# Altium project ultrasonic_ranging.PrjPcb
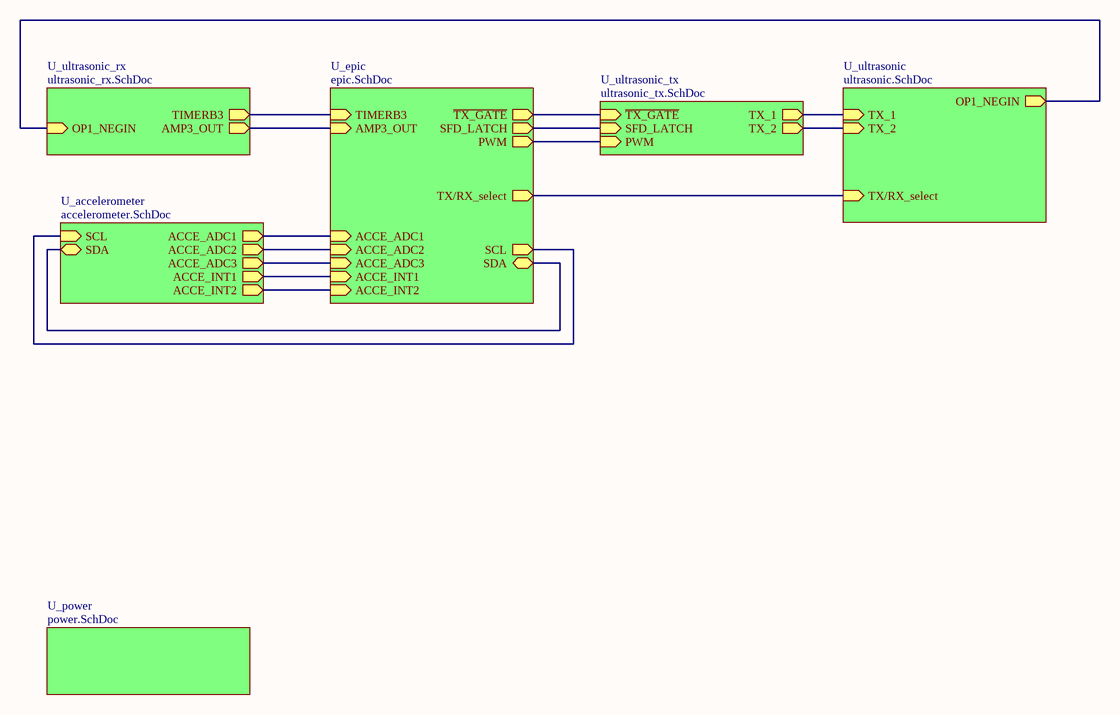
[diagram p0: ultrasonic_top.SchDoc]
7 sheets, 68 parts. Net scope: hierarchical (ports join the sheet entries above them; power ports are global).
Board files: ultrasounic.PcbDoc, ultrasonic_revB.PcbDoc
Sheets:
  ultrasonic_top.SchDoc
    U_accelerometer = accelerometer.SchDoc
    U_epic = epic.SchDoc
    U_ultrasonic = ultrasonic.SchDoc
    U_ultrasonic_rx = ultrasonic_rx.SchDoc
    U_ultrasonic_tx = ultrasonic_tx.SchDoc
    U_power = power.SchDoc

## Sheet ultrasonic_top.SchDoc: Ultrasonic
size Letter; Author: Kuo, Huang; Revision: 2.0; SheetNumber: 1; SheetTotal: 7

### Sub-sheets
U_accelerometer = accelerometer.SchDoc: ACCE_ADC1 (out), ACCE_ADC2 (out), ACCE_ADC3 (out), ACCE_INT1 (out), ACCE_INT2 (out), SCL (in), SDA (bidir)
U_epic = epic.SchDoc: TIMERB3 (in), PWM (out), TX/RX_select (out), ~{TX_GATE} (out), AMP3_OUT (in), ACCE_ADC1 (in), ACCE_ADC2 (in), ACCE_ADC3 (in), ACCE_INT1 (in), ACCE_INT2 (in), SCL (out), SDA (bidir), SFD_LATCH (out)
U_power = power.SchDoc: no entries
U_ultrasonic = ultrasonic.SchDoc: TX/RX_select (in), OP1_NEGIN (out), TX_1 (in), TX_2 (in)
U_ultrasonic_rx = ultrasonic_rx.SchDoc: TIMERB3 (out), OP1_NEGIN (in), AMP3_OUT (out)
U_ultrasonic_tx = ultrasonic_tx.SchDoc: TX_1 (out), TX_2 (out), ~{TX_GATE} (in), SFD_LATCH (in), PWM (in)

### Nets
ACCE_ADC1: sheet U_accelerometer/ACCE_ADC1, sheet U_epic/ACCE_ADC1
ACCE_ADC2: sheet U_accelerometer/ACCE_ADC2, sheet U_epic/ACCE_ADC2
ACCE_ADC3: sheet U_accelerometer/ACCE_ADC3, sheet U_epic/ACCE_ADC3
ACCE_INT1: sheet U_accelerometer/ACCE_INT1, sheet U_epic/ACCE_INT1
ACCE_INT2: sheet U_accelerometer/ACCE_INT2, sheet U_epic/ACCE_INT2
AMP3_OUT: sheet U_epic/AMP3_OUT, sheet U_ultrasonic_rx/AMP3_OUT
OP1_NEGIN: sheet U_ultrasonic/OP1_NEGIN, sheet U_ultrasonic_rx/OP1_NEGIN
PWM: sheet U_epic/PWM, sheet U_ultrasonic_tx/PWM
SCL: sheet U_accelerometer/SCL, sheet U_epic/SCL
SDA: sheet U_accelerometer/SDA, sheet U_epic/SDA
~{TX_GATE}: sheet U_epic/~{TX_GATE}, sheet U_ultrasonic_tx/~{TX_GATE}
TX/RX_select: sheet U_epic/TX/RX_select, sheet U_ultrasonic/TX/RX_select
TX_1: sheet U_ultrasonic/TX_1, sheet U_ultrasonic_tx/TX_1
TX_2: sheet U_ultrasonic/TX_2, sheet U_ultrasonic_tx/TX_2
NetC17_1: sheet U_epic/TIMERB3, sheet U_ultrasonic_rx/TIMERB3
NetU1_4: sheet U_epic/SFD_LATCH, sheet U_ultrasonic_tx/SFD_LATCH

### Notes on the sheet
- Title
- Date:
- Author:
- Revision:
- Sheet
- of
- University of Michigan
- File:

## Sheet accelerometer.SchDoc: Ultrasonic
size Letter; Author: Kuo, Huang; Revision: 2.0; SheetNumber: 7; SheetTotal: 7
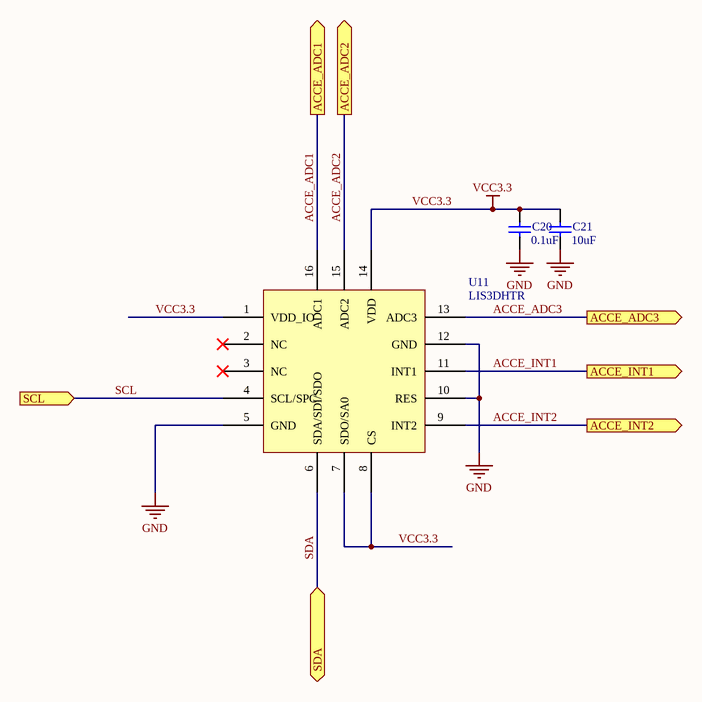
[diagram p1: accelerometer.SchDoc]

### Parts
C20  value 0.1uF  [1608[0603]]  (hidden comment: Cap Semi)
C21  value 10uF  [1608[0603]]  (hidden comment: Cap Semi)
U11  LIS3DHTR  [LGA-16]

### Ports
ACCE_ADC1 (out), ACCE_ADC2 (out), ACCE_ADC3 (out), ACCE_INT1 (out), ACCE_INT2 (out), SCL (in), SDA (bidir)

### Nets
GND: C20.1 C21.1 U11.5(GND) U11.10(RES) U11.12(GND)
VCC3.3: C20.2 C21.2 U11.1(VDD_IO) U11.7(SDO/SA0) U11.8(CS) U11.14(VDD)
ACCE_ADC1: U11.16(ADC1) ; port ACCE_ADC1
ACCE_ADC2: U11.15(ADC2) ; port ACCE_ADC2
ACCE_ADC3: U11.13(ADC3) ; port ACCE_ADC3
ACCE_INT1: U11.11(INT1) ; port ACCE_INT1
ACCE_INT2: U11.9(INT2) ; port ACCE_INT2
SCL: U11.4(SCL/SPC) ; port SCL
SDA: U11.6(SDA/SDI/SDO) ; port SDA

Not connected (* = marked no-connect by the designer): U11 2(NC)* 3(NC)*

### Notes on the sheet
- Title
- Date:
- Author:
- Revision:
- Sheet
- of
- University of Michigan
- File:

### Library data of the parts
C20 C21 = Cap Semi: Capacitor (Semiconductor SIM Model); Published: 8-Jun-2000; LatestRevisionDate: 29-May-2009; LatestRevisionNote: IPC-7351 Footprint Added.; PackageReference: C1206; Publisher: Altium Limited; PackageDescription: Chip Capacitor
U11 = LIS3DHTR: MEMS digital output motion sensor; Supplier 1: Digi-Key; Supplier Part Number 1: 497-10613-6-ND

## Sheet epic.SchDoc: Ultrasonic
size Letter; Author: Kuo, Huang; Organization: Altium Limited; Address1: L3, 12a Rodborough Rd; Address2: Frenchs Forest; Address3: NSW; Address4: Australia 2086; Revision: 2.0; SheetNumber: 3; SheetTotal: 7
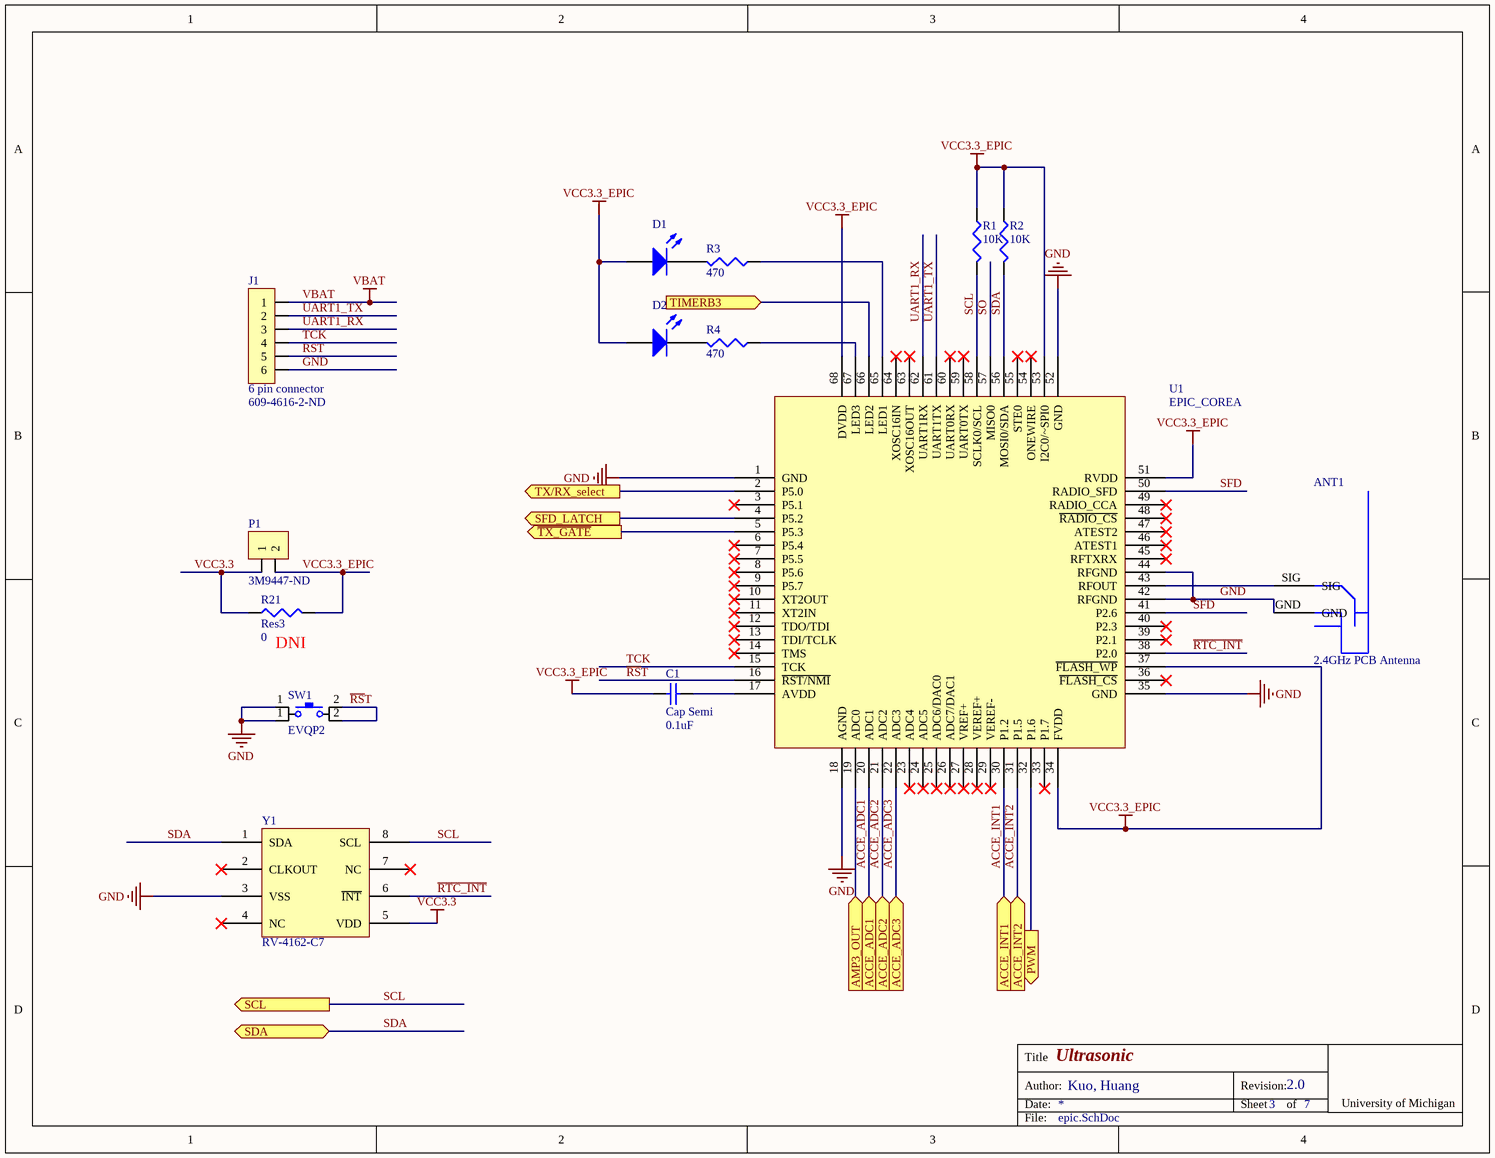
[diagram p2: epic.SchDoc]

### Parts
ANT1  2.4GHz PCB Antenna  [Inverted F Antenna]
C1  Cap Semi  value 0.1uF  [1608[0603]]
D1  LED3  [J1-0603]  (value not drawn)
D2  LED3  [J1-0603]  (value not drawn)
J1  6 pin connector  Supplier Part Number 2: 609-4616-2-ND  [Micro USB]
P1  Supplier Part Number 1: 3M9447-ND  [1x2 header]  (hidden comment: 1 x 2 header)
R1  10K  [J1-0603]
R2  10K  [J1-0603]
R3  470  [J1-0603]
R4  470  [J1-0603]
R21  Res3  value 0  [J1-0603]
SW1  EVQP2  [EVQP2]
U1  EPIC_COREA  [EPIC_LCC68]
Y1  RV-4162-C7  [RV4162]

### Ports
ACCE_ADC1 (in), ACCE_ADC2 (in), ACCE_ADC3 (in), ACCE_INT1 (in), ACCE_INT2 (in), AMP3_OUT (in), PWM (out), SCL (out), SDA (bidir), SFD_LATCH (out), TIMERB3 (in), TX/RX_select (out), ~{TX_GATE} (out)

### Nets
GND: ANT1.GND J1.6 SW1.1 U1.1(GND) U1.18(AGND) U1.35(GND) U1.42(RFGND) U1.44(RFGND) U1.52(GND) Y1.3(VSS)
VBAT: J1.1
VCC3.3: P1.1 R21.1 Y1.5(VDD)
VCC3.3_EPIC: C1.1 D1.1(A) D2.1(A) P1.2 R1.1 R2.1 R21.2 U1.34(FVDD) U1.37(~{FLASH_WP}) U1.51(RVDD) U1.53(I2C0/~SPI0) U1.68(DVDD)
ACCE_ADC1: U1.20(ADC1) ; port ACCE_ADC1
ACCE_ADC2: U1.21(ADC2) ; port ACCE_ADC2
ACCE_ADC3: U1.22(ADC3) ; port ACCE_ADC3
ACCE_INT1: U1.30(P1.2) ; port ACCE_INT1
ACCE_INT2: U1.31(P1.5) ; port ACCE_INT2
AMP3_OUT: U1.19(ADC0) ; port AMP3_OUT
PWM: U1.32(P1.6) ; port PWM
~{RS}T: J1.5 SW1.2 U1.16(~{RST/NMI})
~{RTC_INT}: U1.38(P2.0) Y1.6(~{INT})
SCL: R1.2 U1.58(SCLK0/SCL) Y1.8(SCL) ; port SCL
SDA: R2.2 U1.56(MOSI0/SDA) Y1.1(SDA) ; port SDA
SFD: U1.41(P2.6) U1.50(RADIO_SFD)
SO: U1.57(MISO0)
~{TX_GATE}: U1.5(P5.3) ; port ~{TX_GATE}
TCK: J1.4 U1.15(TCK)
TX/RX_select: U1.2(P5.0) ; port TX/RX_select
UART1_RX: J1.3 U1.62(UART1RX)
UART1_TX: J1.2 U1.61(UART1TX)
NetANT1_SIG: ANT1.SIG U1.43(RFOUT)
NetC1_2: C1.2 U1.17(AVDD)
NetC17_1: U1.66(LED2) ; port TIMERB3
NetD1_2: D1.2(K) R3.2
NetD2_2: D2.2(K) R4.2
NetR3_1: R3.1 U1.65(LED1)
NetR4_1: R4.1 U1.67(LED3)
NetU1_4: U1.4(P5.2) ; port SFD_LATCH

Not connected (* = marked no-connect by the designer): U1 3(P5.1)* 6(P5.4)* 7(P5.5)* 8(P5.6)* 9(P5.7)* 10(XT2OUT)* 11(XT2IN)* 12(TDO/TDI)* 13(TDI/TCLK)* 14(TMS)* 23(ADC4)* 24(ADC5)* 25(ADC6/DAC0)* 26(ADC7/DAC1)* 27(VREF+)* 28(VEREF+)* 29(VEREF-)* 33(P1.7)* 36(~{FLASH_CS})* 39(P2.1)* 40(P2.3)* 45(RFTXRX)* 46(ATEST1)* 47(ATEST2)* 48(~{RADIO_CS})* 49(RADIO_CCA)* 54(ONEWIRE)* 55(STE0)* 59(UART0TX)* 60(UART0RX)* 63(XOSC16OUT)* 64(XOSC16IN)*; Y1 2(CLKOUT)* 4(NC)* 7(NC)*

### Notes on the sheet
- (near R21) DNI
- Title
- Date:
- Author:
- Revision:
- Sheet
- of
- University of Michigan
- File:

### Library data of the parts
C1 = Cap Semi: Capacitor (Semiconductor SIM Model); Published: 8-Jun-2000; LatestRevisionDate: 29-May-2009; LatestRevisionNote: IPC-7351 Footprint Added.; PackageReference: C1206; Publisher: Altium Limited; PackageDescription: Chip Capacitor
D1 D2 = LED3: Typical BLUE SiC LED; Published: 8-Jun-2000; LatestRevisionDate: 17-Dec-2003; LatestRevisionNote: PCB Footprint replaced.; DatasheetVersion: 16-Apr-2002; PackageVersion: 16-Apr-2002; PackageReference: 3.5X2.8X1.9; Publisher: Altium Limited; PackageDescription: SM LED; 2 C-Bend Leads; Body 3.5 x 2.8 x 1.9 mm, inc leads (LxWxH typ)
P1 = 1 x 2 header: 100 mils standard header; Supplier 1: Digi-Key
R1-R4 R21 = Res3: Resistor; Published: 8-Jun-2000; LatestRevisionDate: 29-May-2009; LatestRevisionNote: IPC-7351 Footprint Added.; PackageReference: J1-0603; Publisher: Altium Limited; PackageDescription: Chip Resistor
  R1 R2: Value: 10K
  R3 R4: Value: 470
SW1 = EVQP2: Switch; Supplier 1: Digi-Key; Supplier Part Number 1: P12298SCT-ND
U1 = EPIC_COREA: EPIC Core
Y1 = RV-4162-C7: Real Time Clock Module with I2C Bus; Supplier 1: Allied; Supplier Part Number 1: R1033504
J1 = 6 pin connector: Supplier 1: Digi-Key; Supplier Part Number 1: 732-2018-2-ND; Supplier 2: Digi-Key

## Sheet ultrasonic.SchDoc: Ultrasonic
size Letter; Author: Kuo, Huang; Revision: 2.0; SheetNumber: 2; SheetTotal: 7
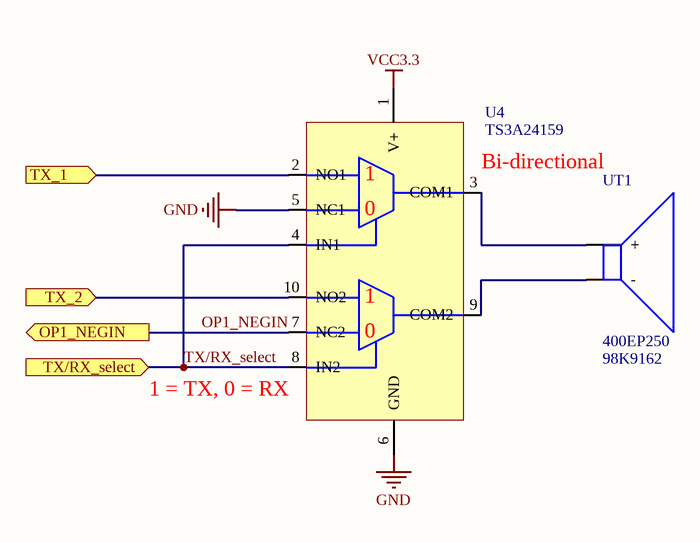
[diagram p3: ultrasonic.SchDoc]

### Parts
U4  TS3A24159  [TSSOP50P490X110-10N]
UT1  400EP250  Supplier Part Number 1: 98K9162  [Transducer recepticle]

### Ports
OP1_NEGIN (out), TX/RX_select (in), TX_1 (in), TX_2 (in)

### Nets
GND: U4.5(NC1) U4.6(GND)
VCC3.3: U4.1(V+)
OP1_NEGIN: U4.7(NC2) ; port OP1_NEGIN
TX/RX_select: U4.4(IN1) U4.8(IN2) ; port TX/RX_select
TX_1: U4.2(NO1) ; port TX_1
TX_2: U4.10(NO2) ; port TX_2
NetU4_3: U4.3(COM1) UT1.2(+)
NetU4_9: U4.9(COM2) UT1.1(-)

### Notes on the sheet
- (near U4) Bi-directional
- (near U4) 1 = TX, 0 = RX
- Title
- Date:
- Author:
- Revision:
- Sheet
- of
- University of Michigan
- File:
- (in symbol TS3A24159) 0

### Library data of the parts
U4 = TS3A24159: DUAL-CHANNEL 2:1 MULTIPLEXER/DEMULTIPLEXER; Supplier 1: Digi-Key; Supplier Part Number 1: 296-21913-1-ND
UT1 = Tranducer: Air Ultrasounic Ceramic Transducers; Supplier 1: Newark

## Sheet ultrasonic_rx.SchDoc: Ultrasonic
size Letter; Author: Kuo, Huang; Revision: 2.0; SheetNumber: 5; SheetTotal: 7
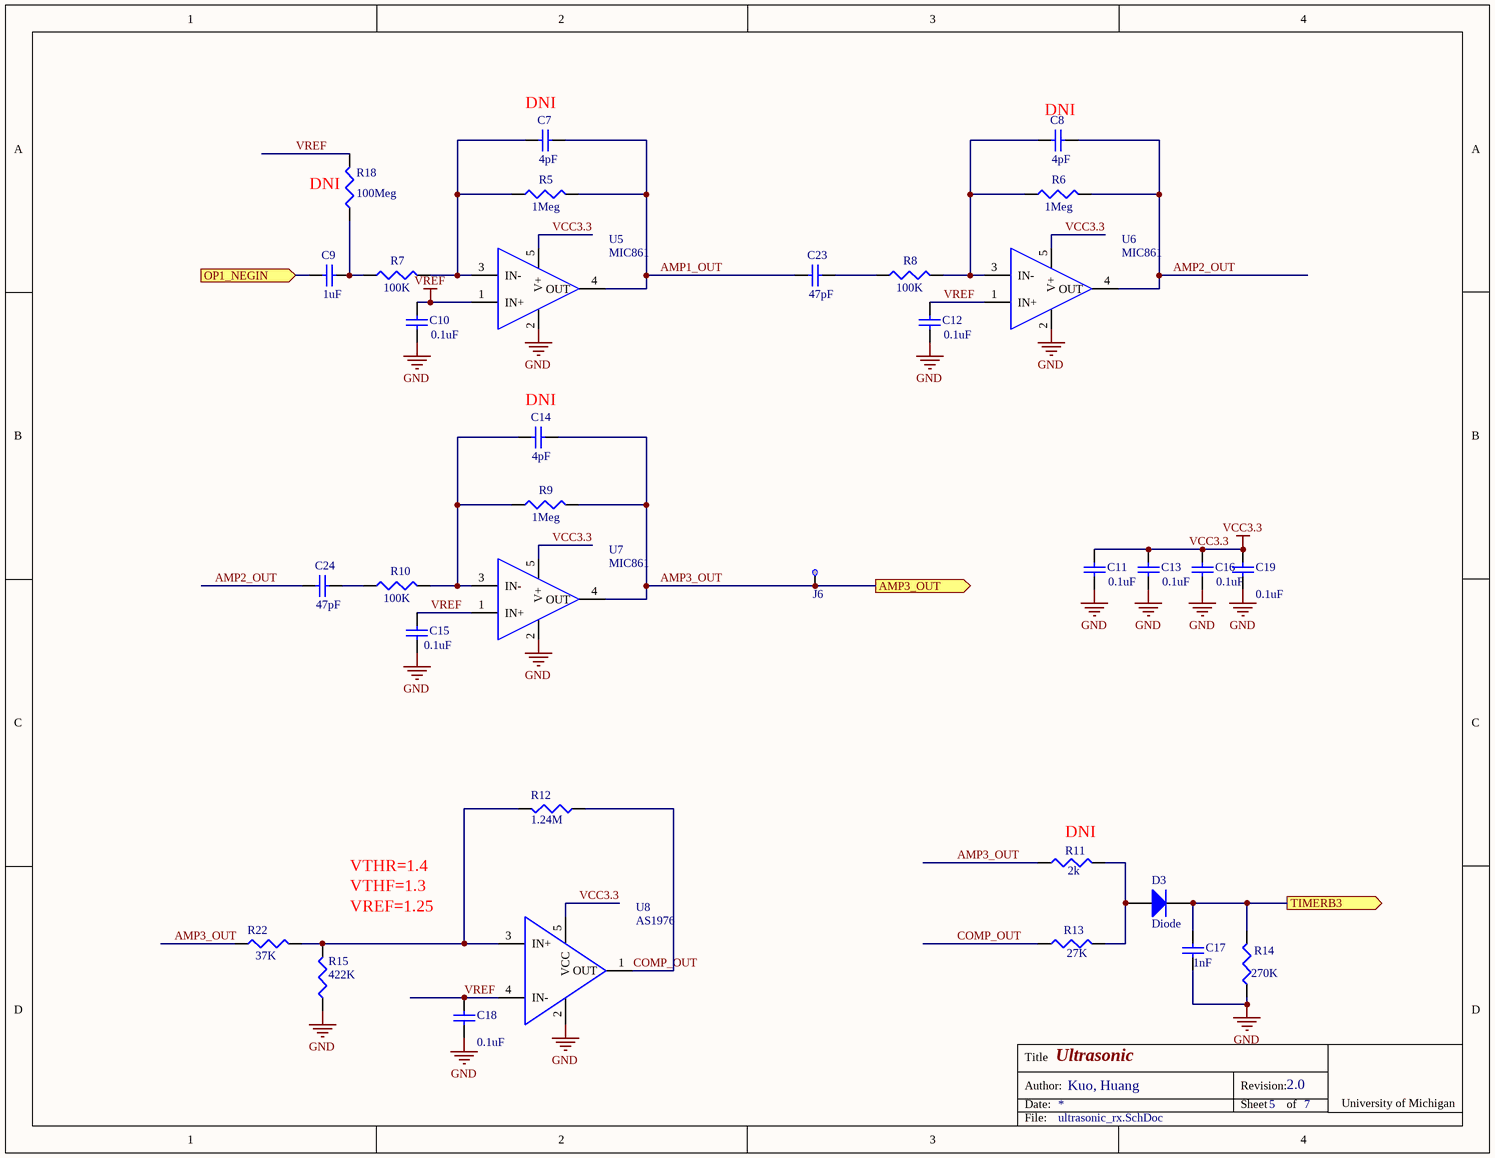
[diagram p4: ultrasonic_rx.SchDoc]

### Parts
C7  value 4pF  [1608[0603]]  (hidden comment: Cap Semi)
C8  value 4pF  [1608[0603]]  (hidden comment: Cap Semi)
C9  value 1uF  [1608[0603]]  (hidden comment: Cap Semi)
C10  value 0.1uF  [1608[0603]]  (hidden comment: Cap Semi)
C11  value 0.1uF  [1608[0603]]  (hidden comment: Cap Semi)
C12  value 0.1uF  [1608[0603]]  (hidden comment: Cap Semi)
C13  value 0.1uF  [1608[0603]]  (hidden comment: Cap Semi)
C14  value 4pF  [1608[0603]]  (hidden comment: Cap Semi)
C15  value 0.1uF  [1608[0603]]  (hidden comment: Cap Semi)
C16  value 0.1uF  [1608[0603]]  (hidden comment: Cap Semi)
C17  value 1nF  [1608[0603]]  (hidden comment: Cap Semi)
C18  value 0.1uF  [1608[0603]]  (hidden comment: Cap Semi)
C19  value 0.1uF  [1608[0603]]  (hidden comment: Cap Semi)
C23  value 47pF  [1608[0603]]  (hidden comment: Cap Semi)
C24  value 47pF  [1608[0603]]  (hidden comment: Cap Semi)
D3  Diode  [J1-0603]
J6  5004  [TestPoint]  (value not drawn)
R5  1Meg  [J1-0603]
R6  1Meg  [J1-0603]
R7  100K  [J1-0603]
R8  100K  [J1-0603]
R9  1Meg  [J1-0603]
R10  100K  [J1-0603]
R11  2k  [J1-0603]
R12  1.24M  [J1-0603]
R13  27K  [J1-0603]
R14  270K  [J1-0603]
R15  422K  [J1-0603]
R18  value 100Meg  [J1-0603]  (hidden comment: Res3)
R22  value 37K  [J1-0603]  (hidden comment: 27K)
U5  MIC861  [SC70-5]
U6  MIC861  [SC70-5]
U7  MIC861  [SC70-5]
U8  AS1976  [SOT23-5]

### Ports
AMP3_OUT (out), OP1_NEGIN (in), TIMERB3 (out)

### Nets
GND: C10.1 C11.1 C12.1 C13.1 C15.1 C16.1 C17.2 C18.1 C19.1 R14.1 R15.1 U5.2(V-) U6.2(V-) U7.2(V-) U8.2(VEE)
VCC3.3: C11.2 C13.2 C16.2 C19.2 U5.5(V+) U6.5(V+) U7.5(V+) U8.5(VCC)
VREF: C10.2 C12.2 C15.2 C18.2 R18.2 U5.1(IN+) U6.1(IN+) U7.1(IN+) U8.4(IN-)
AMP1_OUT: C7.1 C23.1 R5.2 U5.4(OUT)
AMP2_OUT: C8.1 C24.1 R6.2 U6.4(OUT)
AMP3_OUT: C14.1 J6.1(TB) R9.2 R11.1 R22.1 U7.4(OUT) ; port AMP3_OUT
COMP_OUT: R12.1 R13.1 U8.1(OUT)
OP1_NEGIN: C9.2 ; port OP1_NEGIN
NetC7_2: C7.2 R5.1 R7.2 U5.3(IN-)
NetC8_2: C8.2 R6.1 R8.2 U6.3(IN-)
NetC9_1: C9.1 R7.1 R18.1
NetC14_2: C14.2 R9.1 R10.2 U7.3(IN-)
NetC17_1: C17.1 D3.2(K) R14.2 ; port TIMERB3
NetC23_2: C23.2 R8.1
NetC24_2: C24.2 R10.1
NetD3_1: D3.1(A) R11.2 R13.2
NetR12_2: R12.2 R15.2 R22.2 U8.3(IN+)

### Notes on the sheet
- (near C7) DNI
- (near C8) DNI
- (near R18) DNI
- (near C14) DNI
- (near R11) DNI
- VTHR=1.4
- VTHF=1.3
- VREF=1.25
- Title
- Date:
- Author:
- Revision:
- Sheet
- of
- University of Michigan
- File:

### Library data of the parts
C7-C19 C23 C24 = Cap Semi: Capacitor (Semiconductor SIM Model); Published: 8-Jun-2000; LatestRevisionDate: 29-May-2009; LatestRevisionNote: IPC-7351 Footprint Added.; PackageReference: C1206; Publisher: Altium Limited; PackageDescription: Chip Capacitor
D3 = Diode: Default Diode; Published: 8-Jun-2000; LatestRevisionDate: 17-Jul-2002; LatestRevisionNote: Re-released for DXP Platform.; PackageVersion: Sep-1996; PackageReference: SMC; Publisher: Altium Limited; PackageDescription: DO-214-AB/SMC; 2 C-Bend Leads; Body 7.9 x 5.9 mm, inc. leads (LxW); Code_JEDEC: DO-214-AB
J6 = TestPoint: TEST POINT PC MINI .040"D YELLOW; Supplier 1: Digi-Key; Supplier Part Number 1: 5004K-ND; datasheet: http://mail.keyelco.com/ENG._DEPT/PDF%20CAT%20NO%20Drawings/5004.pdf
R5-R15 R18 R22 = Res3: Resistor; Published: 8-Jun-2000; LatestRevisionDate: 29-May-2009; LatestRevisionNote: IPC-7351 Footprint Added.; PackageReference: J1-0603; Publisher: Altium Limited; PackageDescription: Chip Resistor
  R5 R6 R9: Value: 1Meg
  R7 R8 R10: Value: 100K
  R11: Value: 2k
  R12: Value: 1.24M
  R13: Value: 27K
  R14: Value: 270K
  R15: Value: 422K
U5-U7 = MIC861: IC OPAMP 400KHZ 2.7V ULT LP SC70; Supplier 1: Digi-Key; Supplier Part Number 1: 576-2932-1-ND
U8 = AS1976: IC COMPARATOR PUSH/PULL SOT23-5; Supplier 1: Digi-Key; Supplier Part Number 1: AS1976-TCT-ND

## Sheet ultrasonic_tx.SchDoc: Ultrasonic
size Letter; Author: Kuo, Huang; Organization: Altium Limited; Address1: L3, 12a Rodborough Rd; Address2: Frenchs Forest; Address3: NSW; Address4: Australia 2086; Revision: 2.0; SheetNumber: 6; SheetTotal: 7
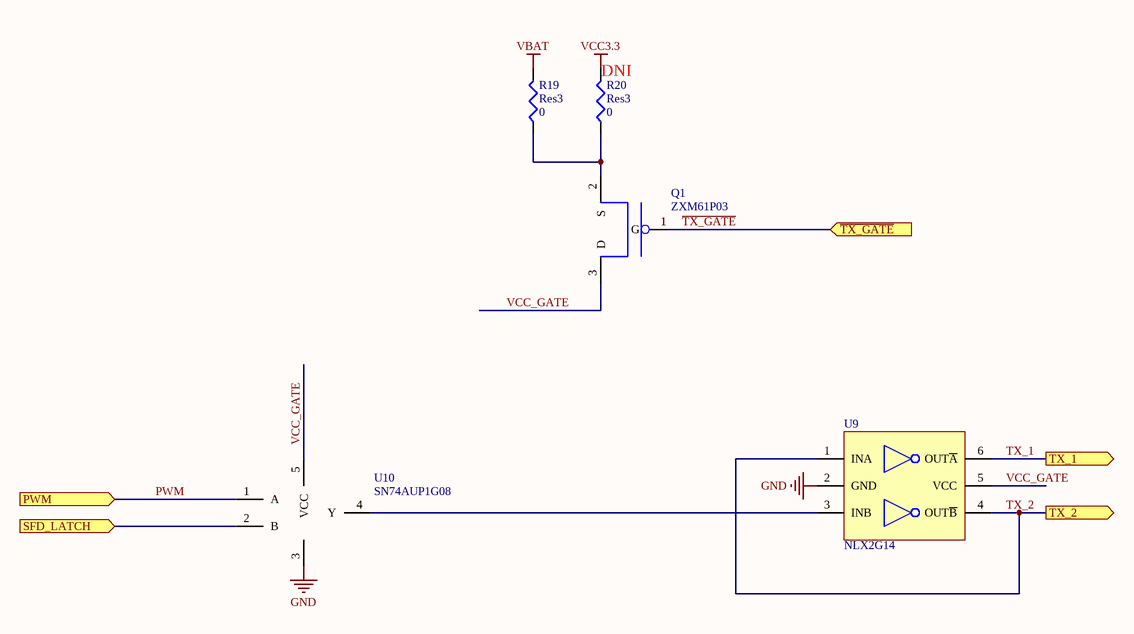
[diagram p5: ultrasonic_tx.SchDoc]

### Parts
Q1  ZXM61P03  [SOT23-3N]
R19  Res3  value 0  [J1-0603]
R20  Res3  value 0  [J1-0603]
U9  NLX2G14  [ULLGA6]
U10  SN74AUP1G08  [SC70-6]

### Ports
PWM (in), SFD_LATCH (in), TX_1 (out), TX_2 (out), ~{TX_GATE} (in)

### Nets
GND: U9.2(GND) U10.3(GND)
VBAT: R19.2
VCC3.3: R20.2
PWM: U10.1(A) ; port PWM
~{TX_GATE}: Q1.1(G) ; port ~{TX_GATE}
TX_1: U9.6(OUT~{A}) ; port TX_1
TX_2: U9.1(INA) U9.4(OUT~{B}) ; port TX_2
VCC_GATE: Q1.3(D) U9.5(VCC) U10.5(VCC)
NetQ1_2: Q1.2(S) R19.1 R20.1
NetU1_4: U10.2(B) ; port SFD_LATCH
NetU9_3: U9.3(INB) U10.4(Y)

### Notes on the sheet
- (near R20) DNI
- Title
- Date:
- Author:
- Revision:
- Sheet
- of
- University of Michigan
- File:

### Library data of the parts
Q1 = ZXM61P03: 30V P-CHANNEL ENHANCEMENT MODE MOSFET; Supplier 1: Digi-Key; Supplier Part Number 1: ZXM61P03FCT-ND
R19 R20 = Res3: Resistor; Published: 8-Jun-2000; LatestRevisionDate: 29-May-2009; LatestRevisionNote: IPC-7351 Footprint Added.; PackageReference: J1-0603; Publisher: Altium Limited; PackageDescription: Chip Resistor
U9 = NLX2G14: Dual Schmitt-Trigger  Inverter; Supplier 1: Digi-Key; Supplier Part Number 1: NLX2G14AMX1TCGOSCT-ND
U10 = SN74AUP1G08: LOW-POWER SINGLE 2-INPUT POSITIVE-AND GATE; Supplier 1: Digi-Key; Supplier Part Number 1: 296-19074-1-ND

## Sheet power.SchDoc: Ultrasonic
size Letter; Author: Kuo, Huang; Revision: 2.0; SheetNumber: 4; SheetTotal: 7
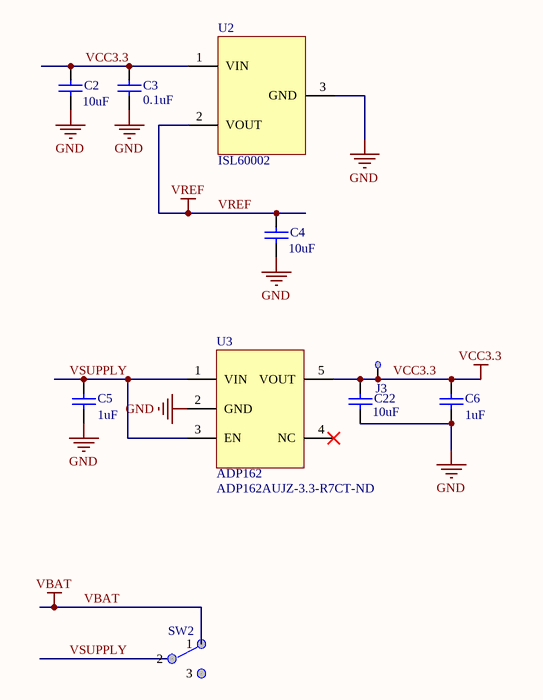
[diagram p6: power.SchDoc]

### Parts
C2  value 10uF  [1608[0603]]  (hidden comment: Cap Semi)
C3  value 0.1uF  [1608[0603]]  (hidden comment: Cap Semi)
C4  value 10uF  [1608[0603]]  (hidden comment: Cap Semi)
C5  value 1uF  [1608[0603]]  (hidden comment: Cap Semi)
C6  value 1uF  [1608[0603]]  (hidden comment: Cap Semi)
C22  value 10uF  [1608[0603]]  (hidden comment: Cap Semi)
J3  5004  [TestPoint]  (value not drawn)
SW2  EG1218  [Slide Switch SPDT]  (value not drawn)
U2  ISL60002  [SOT23-3N]
U3  ADP162  Supplier Part Number 1: ADP162AUJZ-3.3-R7CT-ND  [TSOT23-5]

### Nets
GND: C2.1 C3.1 C4.1 C5.1 C6.1 C22.1 U2.3(GND) U3.2(GND)
VBAT: SW2.1
VCC3.3: C2.2 C3.2 C6.2 C22.2 J3.1(TB) U2.1(VIN) U3.5(VOUT)
VREF: C4.2 U2.2(VOUT)
VSUPPLY: C5.2 SW2.2 U3.1(VIN) U3.3(EN)

Not connected (* = marked no-connect by the designer): SW2 3; U3 4(NC)*

### Notes on the sheet
- Title
- Date:
- Author:
- Revision:
- Sheet
- of
- University of Michigan
- File:

### Library data of the parts
C2-C6 C22 = Cap Semi: Capacitor (Semiconductor SIM Model); Published: 8-Jun-2000; LatestRevisionDate: 29-May-2009; LatestRevisionNote: IPC-7351 Footprint Added.; PackageReference: C1206; Publisher: Altium Limited; PackageDescription: Chip Capacitor
J3 = TestPoint: TEST POINT PC MINI .040"D YELLOW; Supplier 1: Digi-Key; Supplier Part Number 1: 5004K-ND; datasheet: http://mail.keyelco.com/ENG._DEPT/PDF%20CAT%20NO%20Drawings/5004.pdf
SW2 = EG1218: Switch 3 Pos; Supplier 1: Digi-Key; Supplier Part Number 1: EG1903-ND; Supplier 2: Digi-Key; Supplier Part Number 2: 450-1598-ND; Supplier 3: Digi-Key; Supplier Part Number 3: 450-1577-ND
U2 = ISL60002: Precision Low Power FGA? Voltage References; Supplier 1: Digi-Key; Supplier Part Number 1: ISL60002DIH310Z-TKCT-ND
U3 = ADP162: Ultralow Quiescent Current,  150 mA, CMOS Linear Regulators; Supplier 1: Digi-Key

## Nets that join several sheets
GND: accelerometer (5 pins), epic (10 pins), ultrasonic (U4.5 U4.6), ultrasonic_rx (15 pins), ultrasonic_tx (U9.2 U10.3), power (8 pins)
VBAT: epic (J1.1), ultrasonic_tx (R19.2), power (SW2.1)
VCC3.3: accelerometer (6 pins), epic (P1.1 R21.1 Y1.5), ultrasonic (U4.1), ultrasonic_rx (8 pins), ultrasonic_tx (R20.2), power (7 pins)
VREF: ultrasonic_rx (9 pins), power (C4.2 U2.2)
ACCE_ADC1: accelerometer (U11.16), epic (U1.20)
ACCE_ADC2: accelerometer (U11.15), epic (U1.21)
ACCE_ADC3: accelerometer (U11.13), epic (U1.22)
ACCE_INT1: accelerometer (U11.11), epic (U1.30)
ACCE_INT2: accelerometer (U11.9), epic (U1.31)
AMP3_OUT: epic (U1.19), ultrasonic_rx (6 pins)
NetC17_1: epic (U1.66), ultrasonic_rx (C17.1 D3.2 R14.2)
NetU1_4: epic (U1.4), ultrasonic_tx (U10.2)
OP1_NEGIN: ultrasonic (U4.7), ultrasonic_rx (C9.2)
PWM: epic (U1.32), ultrasonic_tx (U10.1)
SCL: accelerometer (U11.4), epic (R1.2 U1.58 Y1.8)
SDA: accelerometer (U11.6), epic (R2.2 U1.56 Y1.1)
~{TX_GATE}: epic (U1.5), ultrasonic_tx (Q1.1)
TX/RX_select: epic (U1.2), ultrasonic (U4.4 U4.8)
TX_1: ultrasonic (U4.2), ultrasonic_tx (U9.6)
TX_2: ultrasonic (U4.10), ultrasonic_tx (U9.1 U9.4)